# EAGLE schematic id_eeprom (EAGLE 9.3.2)
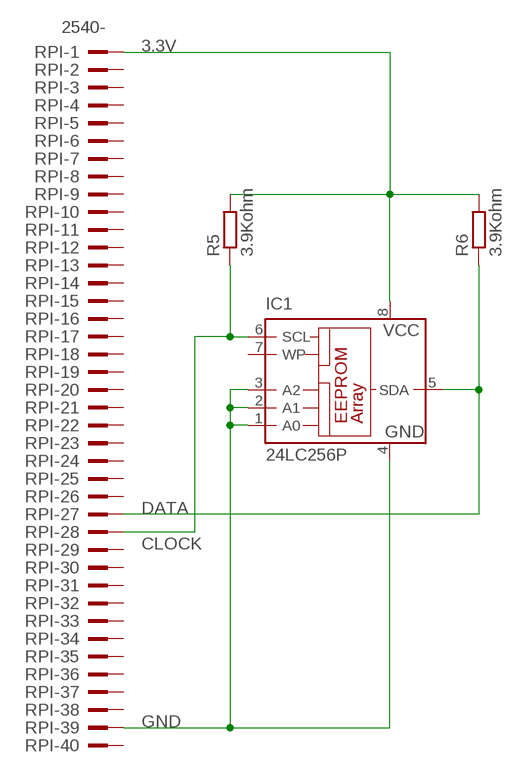
[diagram p0: schematic, sheet 1]

## Parts
IC1  24LC256P  [DIL8]
R5  3.9Kohm  R-EU_0207/7  [0207/7]
R6  3.9Kohm  R-EU_0207/7  [0207/7]
RPI  2540-  [PAK100/2500-40]

## Nets
3.3V: IC1.8(VCC) R5.2 R6.2 RPI.1
CLOCK: IC1.6(SCL) R5.1 RPI.28
DATA: IC1.5(SDA) R6.1 RPI.27
GND: IC1.1(A0) IC1.2(A1) IC1.3(A2) IC1.4(GND) RPI.39
Unconnected: IC1.7(WP) RPI.2 RPI.3 RPI.4 RPI.5 RPI.6 RPI.7 RPI.8 RPI.9 RPI.10 RPI.11 RPI.12 RPI.13 RPI.14 RPI.15 RPI.16 RPI.17 RPI.18 RPI.19 RPI.20 RPI.21 RPI.22 RPI.23 RPI.24 RPI.25 RPI.26 RPI.29 RPI.30 RPI.31 RPI.32 RPI.33 RPI.34 RPI.35 RPI.36 RPI.37 RPI.38 RPI.40

## Library data of the parts
IC1 = microchip-3:24*: Serial EEPROM I2C
R5 R6 = rcl:R-EU_: RESISTOR, European symbol; SPICEPREFIX: R
RPI = con-3m:2540-: 3M (TM) Pak 100 4-Wall Header Source: 3M; OC_FARNELL: unknown; OC_NEWARK: unknown

## Net classes
0 default: width 0.635 mm
1 ground: width 1.27 mm
2 vcc: width 1.27 mm
3 audio: width 1.27 mm